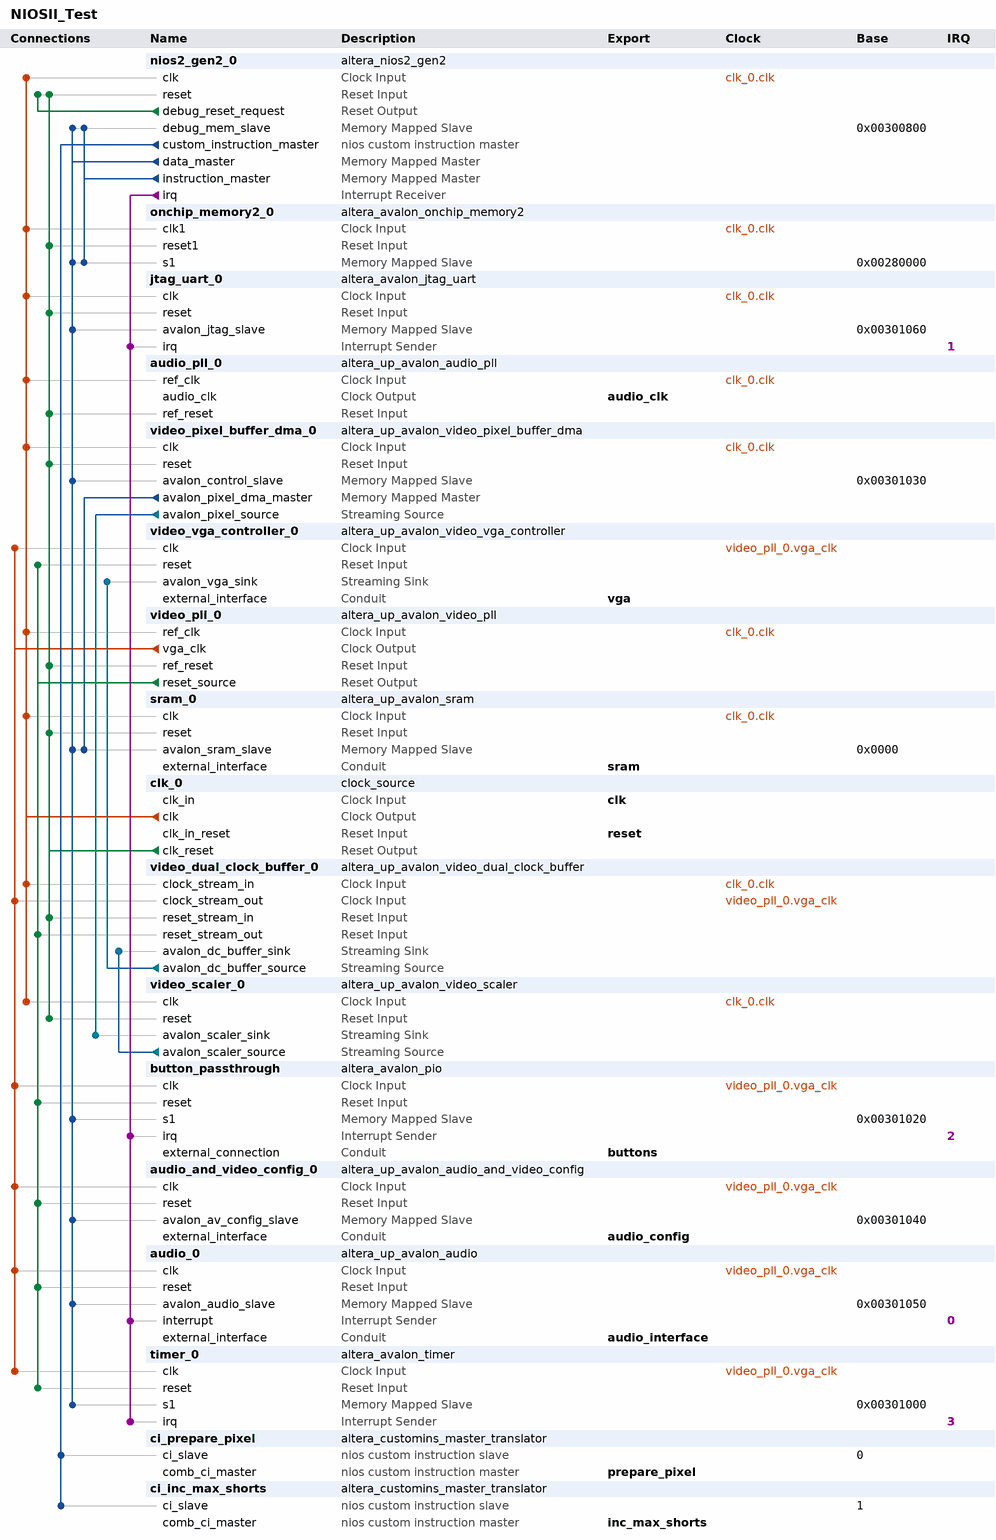
[diagram p0: system contents]
# Platform Designer (Qsys) system NIOSII_Test, Cyclone IV E EP4CE115F29C7
# Parameters at their usual value, and those the tool derives, are not listed.
package require -exact qsys 18.1
create_system NIOSII_Test
set_project_property DEVICE_FAMILY {Cyclone IV E}
set_project_property DEVICE EP4CE115F29C7

add_instance nios2_gen2_0 altera_nios2_gen2 18.1
set_instance_parameter_value nios2_gen2_0 dcache_size 2048
set_instance_parameter_value nios2_gen2_0 dividerType srt2
set_instance_parameter_value nios2_gen2_0 exceptionSlave onchip_memory2_0.s1
set_instance_parameter_value nios2_gen2_0 icache_size 4096
set_instance_parameter_value nios2_gen2_0 impl Fast
set_instance_parameter_value nios2_gen2_0 mul_64_impl 1
set_instance_parameter_value nios2_gen2_0 mul_shift_choice 1
set_instance_parameter_value nios2_gen2_0 resetSlave onchip_memory2_0.s1

add_instance onchip_memory2_0 altera_avalon_onchip_memory2 18.1
set_instance_parameter_value onchip_memory2_0 dataWidth 32
set_instance_parameter_value onchip_memory2_0 dualPort false
set_instance_parameter_value onchip_memory2_0 initMemContent true
set_instance_parameter_value onchip_memory2_0 initializationFileName onchip_mem.hex
set_instance_parameter_value onchip_memory2_0 memorySize 400000
set_instance_parameter_value onchip_memory2_0 readDuringWriteMode OLD_DATA
set_instance_parameter_value onchip_memory2_0 singleClockOperation true

add_instance jtag_uart_0 altera_avalon_jtag_uart 18.1
set_instance_parameter_value jtag_uart_0 simInteractiveOptions NO_INTERACTIVE_WINDOWS

add_instance audio_pll_0 altera_up_avalon_audio_pll 18.0
set_instance_parameter_value audio_pll_0 gui_refclk 50.0

add_instance video_pixel_buffer_dma_0 altera_up_avalon_video_pixel_buffer_dma 18.0
set_instance_parameter_value video_pixel_buffer_dma_0 addr_mode X-Y
set_instance_parameter_value video_pixel_buffer_dma_0 back_start_address 0
set_instance_parameter_value video_pixel_buffer_dma_0 color_space {30-bit RGB}
set_instance_parameter_value video_pixel_buffer_dma_0 image_height 240
set_instance_parameter_value video_pixel_buffer_dma_0 image_width 320
set_instance_parameter_value video_pixel_buffer_dma_0 start_address 0

add_instance video_vga_controller_0 altera_up_avalon_video_vga_controller 18.1
set_instance_parameter_value video_vga_controller_0 board DE2-115
set_instance_parameter_value video_vga_controller_0 resolution {VGA 640x480}

add_instance video_pll_0 altera_up_avalon_video_pll 18.0
set_instance_parameter_value video_pll_0 camera {5MP Digital Camera (THDB_D5M)}
set_instance_parameter_value video_pll_0 gui_refclk 50.0
set_instance_parameter_value video_pll_0 lcd {7" LCD on VEEK-MT and MTL/MTL2 Modules}

add_instance sram_0 altera_up_avalon_sram 18.0
set_instance_parameter_value sram_0 board DE2-115
set_instance_parameter_value sram_0 pixel_buffer true

add_instance clk_0 clock_source 18.1
set_instance_parameter_value clk_0 clockFrequency 50000000

add_instance video_dual_clock_buffer_0 altera_up_avalon_video_dual_clock_buffer 18.0
set_instance_parameter_value video_dual_clock_buffer_0 color_bits 10

add_instance video_scaler_0 altera_up_avalon_video_scaler 18.0
set_instance_parameter_value video_scaler_0 color_bits 10
set_instance_parameter_value video_scaler_0 color_planes 3
set_instance_parameter_value video_scaler_0 height_scaling 2
set_instance_parameter_value video_scaler_0 width_in 320
set_instance_parameter_value video_scaler_0 width_scaling 2

add_instance button_passthrough altera_avalon_pio 18.1
set_instance_parameter_value button_passthrough captureEdge true
set_instance_parameter_value button_passthrough direction Input
set_instance_parameter_value button_passthrough edgeType FALLING
set_instance_parameter_value button_passthrough generateIRQ true
set_instance_parameter_value button_passthrough irqType EDGE
set_instance_parameter_value button_passthrough width 4

add_instance audio_and_video_config_0 altera_up_avalon_audio_and_video_config 18.0
set_instance_parameter_value audio_and_video_config_0 audio_in {Microphone to ADC}
set_instance_parameter_value audio_and_video_config_0 bit_length 16
set_instance_parameter_value audio_and_video_config_0 board DE2-115
set_instance_parameter_value audio_and_video_config_0 dac_enable false
set_instance_parameter_value audio_and_video_config_0 line_in_bypass false
set_instance_parameter_value audio_and_video_config_0 sampling_rate {8 kHz}

add_instance audio_0 altera_up_avalon_audio 18.0
set_instance_parameter_value audio_0 audio_in true
set_instance_parameter_value audio_0 audio_out false
set_instance_parameter_value audio_0 avalon_bus_type {Memory Mapped}
set_instance_parameter_value audio_0 dw 16

add_instance timer_0 altera_avalon_timer 18.1
set_instance_parameter_value timer_0 alwaysRun true
set_instance_parameter_value timer_0 fixedPeriod true
set_instance_parameter_value timer_0 period 1
set_instance_parameter_value timer_0 periodUnits MSEC
set_instance_parameter_value timer_0 snapshot false

add_instance ci_prepare_pixel altera_customins_master_translator 18.1
set_instance_parameter_value ci_prepare_pixel ENABLE_MULTICYCLE 0
set_instance_parameter_value ci_prepare_pixel SHARED_COMB_AND_MULTI 0
set_instance_parameter_value ci_prepare_pixel USE_DATAA 1
set_instance_parameter_value ci_prepare_pixel USE_DATAB 1
set_instance_parameter_value ci_prepare_pixel USE_DONE 0
set_instance_parameter_value ci_prepare_pixel USE_ESTATUS 0
set_instance_parameter_value ci_prepare_pixel USE_IPENDING 0
set_instance_parameter_value ci_prepare_pixel USE_MULTI_DATAA 0
set_instance_parameter_value ci_prepare_pixel USE_MULTI_DATAB 0
set_instance_parameter_value ci_prepare_pixel USE_MULTI_N 0
set_instance_parameter_value ci_prepare_pixel USE_MULTI_READRA 0
set_instance_parameter_value ci_prepare_pixel USE_MULTI_READRB 0
set_instance_parameter_value ci_prepare_pixel USE_MULTI_RESULT 0
set_instance_parameter_value ci_prepare_pixel USE_MULTI_WRITERC 0
set_instance_parameter_value ci_prepare_pixel USE_N 0
set_instance_parameter_value ci_prepare_pixel USE_READRA 0
set_instance_parameter_value ci_prepare_pixel USE_READRB 0
set_instance_parameter_value ci_prepare_pixel USE_START 0
set_instance_parameter_value ci_prepare_pixel USE_WRITERC 0

add_instance ci_inc_max_shorts altera_customins_master_translator 18.1
set_instance_parameter_value ci_inc_max_shorts ENABLE_MULTICYCLE 0
set_instance_parameter_value ci_inc_max_shorts SHARED_COMB_AND_MULTI 0
set_instance_parameter_value ci_inc_max_shorts USE_DATAA 1
set_instance_parameter_value ci_inc_max_shorts USE_DATAB 1
set_instance_parameter_value ci_inc_max_shorts USE_DONE 0
set_instance_parameter_value ci_inc_max_shorts USE_ESTATUS 0
set_instance_parameter_value ci_inc_max_shorts USE_IPENDING 0
set_instance_parameter_value ci_inc_max_shorts USE_MULTI_DATAA 0
set_instance_parameter_value ci_inc_max_shorts USE_MULTI_DATAB 0
set_instance_parameter_value ci_inc_max_shorts USE_MULTI_N 0
set_instance_parameter_value ci_inc_max_shorts USE_MULTI_READRA 0
set_instance_parameter_value ci_inc_max_shorts USE_MULTI_READRB 0
set_instance_parameter_value ci_inc_max_shorts USE_MULTI_RESULT 0
set_instance_parameter_value ci_inc_max_shorts USE_MULTI_WRITERC 0
set_instance_parameter_value ci_inc_max_shorts USE_N 0
set_instance_parameter_value ci_inc_max_shorts USE_READRA 0
set_instance_parameter_value ci_inc_max_shorts USE_READRB 0
set_instance_parameter_value ci_inc_max_shorts USE_START 0
set_instance_parameter_value ci_inc_max_shorts USE_WRITERC 0

# connections
add_connection clk_0.clk audio_pll_0.ref_clk clock
add_connection clk_0.clk jtag_uart_0.clk clock
add_connection clk_0.clk nios2_gen2_0.clk clock
add_connection clk_0.clk onchip_memory2_0.clk1 clock
add_connection clk_0.clk sram_0.clk clock
add_connection clk_0.clk video_dual_clock_buffer_0.clock_stream_in clock
add_connection clk_0.clk video_pixel_buffer_dma_0.clk clock
add_connection clk_0.clk video_pll_0.ref_clk clock
add_connection clk_0.clk video_scaler_0.clk clock
add_connection video_pll_0.vga_clk audio_0.clk clock
add_connection video_pll_0.vga_clk audio_and_video_config_0.clk clock
add_connection video_pll_0.vga_clk button_passthrough.clk clock
add_connection video_pll_0.vga_clk timer_0.clk clock
add_connection video_pll_0.vga_clk video_dual_clock_buffer_0.clock_stream_out clock
add_connection video_pll_0.vga_clk video_vga_controller_0.clk clock
add_connection clk_0.clk_reset audio_pll_0.ref_reset reset
add_connection clk_0.clk_reset jtag_uart_0.reset reset
add_connection clk_0.clk_reset nios2_gen2_0.reset reset
add_connection clk_0.clk_reset onchip_memory2_0.reset1 reset
add_connection clk_0.clk_reset sram_0.reset reset
add_connection clk_0.clk_reset video_dual_clock_buffer_0.reset_stream_in reset
add_connection clk_0.clk_reset video_pixel_buffer_dma_0.reset reset
add_connection clk_0.clk_reset video_pll_0.ref_reset reset
add_connection clk_0.clk_reset video_scaler_0.reset reset
add_connection nios2_gen2_0.debug_reset_request nios2_gen2_0.reset reset
add_connection video_pll_0.reset_source audio_0.reset reset
add_connection video_pll_0.reset_source audio_and_video_config_0.reset reset
add_connection video_pll_0.reset_source button_passthrough.reset reset
add_connection video_pll_0.reset_source timer_0.reset reset
add_connection video_pll_0.reset_source video_dual_clock_buffer_0.reset_stream_out reset
add_connection video_pll_0.reset_source video_vga_controller_0.reset reset
add_connection nios2_gen2_0.data_master audio_0.avalon_audio_slave avalon
set_connection_parameter_value nios2_gen2_0.data_master/audio_0.avalon_audio_slave baseAddress 0x00301050
add_connection nios2_gen2_0.data_master audio_and_video_config_0.avalon_av_config_slave avalon
set_connection_parameter_value nios2_gen2_0.data_master/audio_and_video_config_0.avalon_av_config_slave baseAddress 0x00301040
add_connection nios2_gen2_0.data_master button_passthrough.s1 avalon
set_connection_parameter_value nios2_gen2_0.data_master/button_passthrough.s1 baseAddress 0x00301020
add_connection nios2_gen2_0.data_master jtag_uart_0.avalon_jtag_slave avalon
set_connection_parameter_value nios2_gen2_0.data_master/jtag_uart_0.avalon_jtag_slave baseAddress 0x00301060
add_connection nios2_gen2_0.data_master nios2_gen2_0.debug_mem_slave avalon
set_connection_parameter_value nios2_gen2_0.data_master/nios2_gen2_0.debug_mem_slave baseAddress 0x00300800
add_connection nios2_gen2_0.data_master onchip_memory2_0.s1 avalon
set_connection_parameter_value nios2_gen2_0.data_master/onchip_memory2_0.s1 baseAddress 0x00280000
add_connection nios2_gen2_0.data_master sram_0.avalon_sram_slave avalon
set_connection_parameter_value nios2_gen2_0.data_master/sram_0.avalon_sram_slave baseAddress 0x0000
add_connection nios2_gen2_0.data_master timer_0.s1 avalon
set_connection_parameter_value nios2_gen2_0.data_master/timer_0.s1 baseAddress 0x00301000
add_connection nios2_gen2_0.data_master video_pixel_buffer_dma_0.avalon_control_slave avalon
set_connection_parameter_value nios2_gen2_0.data_master/video_pixel_buffer_dma_0.avalon_control_slave baseAddress 0x00301030
add_connection nios2_gen2_0.instruction_master nios2_gen2_0.debug_mem_slave avalon
set_connection_parameter_value nios2_gen2_0.instruction_master/nios2_gen2_0.debug_mem_slave baseAddress 0x00300800
add_connection nios2_gen2_0.instruction_master onchip_memory2_0.s1 avalon
set_connection_parameter_value nios2_gen2_0.instruction_master/onchip_memory2_0.s1 baseAddress 0x00280000
add_connection video_pixel_buffer_dma_0.avalon_pixel_dma_master sram_0.avalon_sram_slave avalon
set_connection_parameter_value video_pixel_buffer_dma_0.avalon_pixel_dma_master/sram_0.avalon_sram_slave baseAddress 0x0000
add_connection video_dual_clock_buffer_0.avalon_dc_buffer_source video_vga_controller_0.avalon_vga_sink avalon_streaming
add_connection video_pixel_buffer_dma_0.avalon_pixel_source video_scaler_0.avalon_scaler_sink avalon_streaming
add_connection video_scaler_0.avalon_scaler_source video_dual_clock_buffer_0.avalon_dc_buffer_sink avalon_streaming
add_connection nios2_gen2_0.irq audio_0.interrupt interrupt
set_connection_parameter_value nios2_gen2_0.irq/audio_0.interrupt irqNumber 0
add_connection nios2_gen2_0.irq button_passthrough.irq interrupt
set_connection_parameter_value nios2_gen2_0.irq/button_passthrough.irq irqNumber 2
add_connection nios2_gen2_0.irq jtag_uart_0.irq interrupt
set_connection_parameter_value nios2_gen2_0.irq/jtag_uart_0.irq irqNumber 1
add_connection nios2_gen2_0.irq timer_0.irq interrupt
set_connection_parameter_value nios2_gen2_0.irq/timer_0.irq irqNumber 3
add_connection nios2_gen2_0.custom_instruction_master ci_inc_max_shorts.ci_slave nios_custom_instruction
set_connection_parameter_value nios2_gen2_0.custom_instruction_master/ci_inc_max_shorts.ci_slave CIName ci_inc_max_shorts
set_connection_parameter_value nios2_gen2_0.custom_instruction_master/ci_inc_max_shorts.ci_slave baseAddress 1
add_connection nios2_gen2_0.custom_instruction_master ci_prepare_pixel.ci_slave nios_custom_instruction
set_connection_parameter_value nios2_gen2_0.custom_instruction_master/ci_prepare_pixel.ci_slave CIName ci_prepare_pixel
set_connection_parameter_value nios2_gen2_0.custom_instruction_master/ci_prepare_pixel.ci_slave baseAddress 0

# exported interfaces
add_interface audio_clk clock source
set_interface_property audio_clk EXPORT_OF audio_pll_0.audio_clk
add_interface audio_config conduit end
set_interface_property audio_config EXPORT_OF audio_and_video_config_0.external_interface
add_interface audio_interface conduit end
set_interface_property audio_interface EXPORT_OF audio_0.external_interface
add_interface buttons conduit end
set_interface_property buttons EXPORT_OF button_passthrough.external_connection
add_interface clk clock sink
set_interface_property clk EXPORT_OF clk_0.clk_in
add_interface inc_max_shorts nios_custom_instruction start
set_interface_property inc_max_shorts EXPORT_OF ci_inc_max_shorts.comb_ci_master
add_interface prepare_pixel nios_custom_instruction start
set_interface_property prepare_pixel EXPORT_OF ci_prepare_pixel.comb_ci_master
add_interface reset reset sink
set_interface_property reset EXPORT_OF clk_0.clk_in_reset
add_interface sram conduit end
set_interface_property sram EXPORT_OF sram_0.external_interface
add_interface vga conduit end
set_interface_property vga EXPORT_OF video_vga_controller_0.external_interface

set_interconnect_requirement {$system} qsys_mm.clockCrossingAdapter HANDSHAKE
set_interconnect_requirement {$system} qsys_mm.enableEccProtection FALSE
set_interconnect_requirement {$system} qsys_mm.insertDefaultSlave FALSE
set_interconnect_requirement {$system} qsys_mm.maxAdditionalLatency 1

save_system NIOSII_Test.qsys
